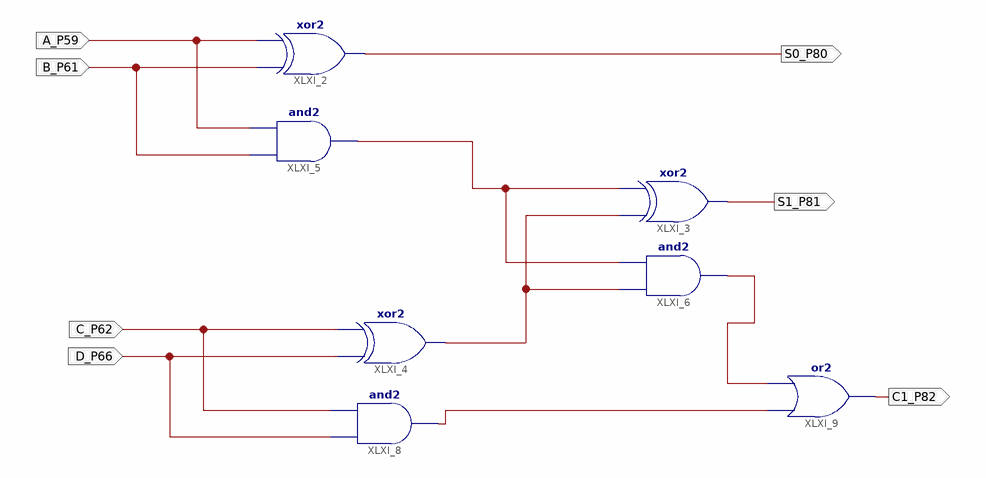
[diagram p0: schematic sheet 1]
// Xilinx ISE schematic Alps.sch (spartan6) as structural Verilog: 7 symbols, 7 ports
module Alps (
  input  A_P59,
  input  B_P61,
  input  C_P62,
  input  D_P66,
  output S0_P80,
  output S1_P81,
  output C1_P82
);

  wire XLXN_7, XLXN_12, XLXN_13, XLXN_16;

  xor XLXI_2 (S0_P80, B_P61, A_P59);
  xor XLXI_3 (S1_P81, XLXN_12, XLXN_7);
  xor XLXI_4 (XLXN_12, D_P66, C_P62);
  and XLXI_5 (XLXN_7, B_P61, A_P59);
  and XLXI_6 (XLXN_16, XLXN_12, XLXN_7);
  and XLXI_8 (XLXN_13, D_P66, C_P62);
  or XLXI_9 (C1_P82, XLXN_13, XLXN_16);
endmodule
